# Altium schematic sheet digital_host_for_ADS1216_MAX337_to_Hall_1.SchDoc
size 420 x 297 mm; Address1: Address1; Address2: Address2; Address3: Address3; Address4: Address4; SheetNumber: 1; Scale: 1:1; Разраб.: Иванов; Обозначение документа: АБВГ.123456.001 Э3; Пров.: Петров; Утв.: Сидоров; Наименование организации: ОАО "Концерн "МПО-Гидроприбор"; Перв. применение: АБВГ.123456.000; Наименование изделия 1: Плата; Наименование изделия 2: Схема электрическая; Наименование изделия 3: принципиальная; Нач. отд.: Нач. отд.; Фамилия нач. отд.: Сидоров
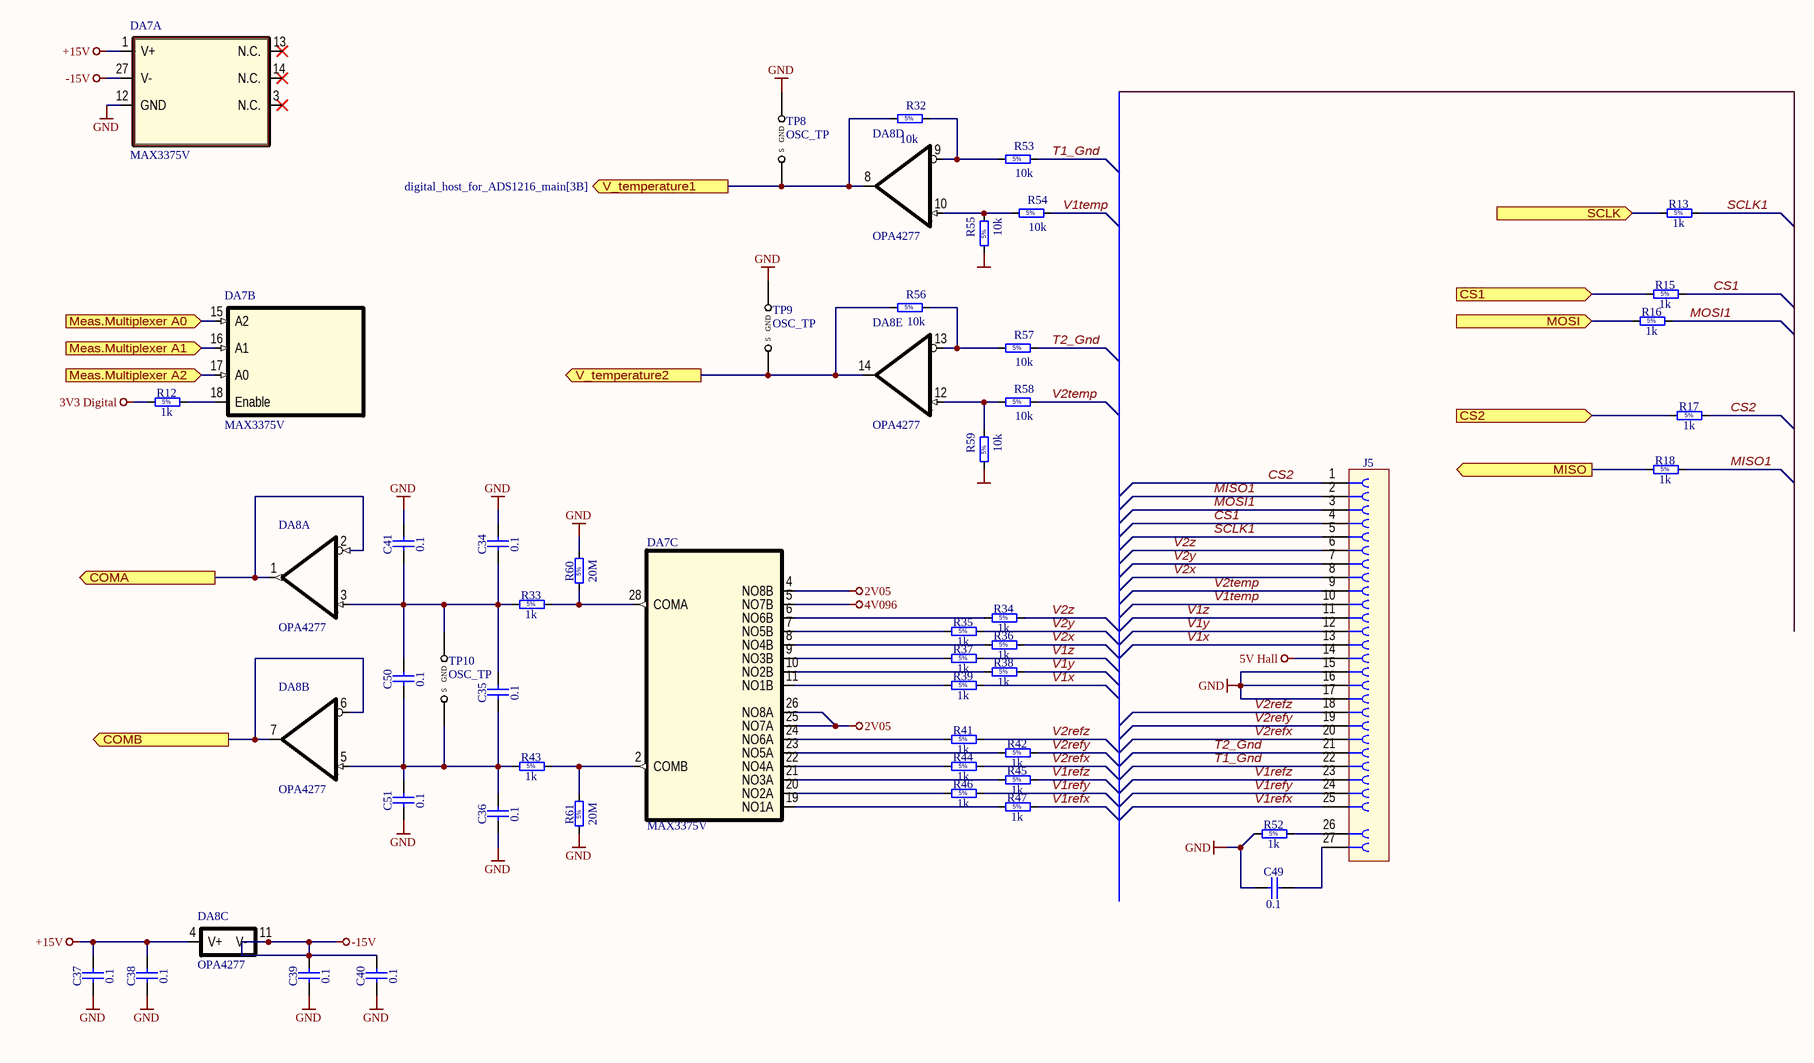
[diagram p0: digital_host_for_ADS1216_MAX337_to_Hall_1.SchDoc]

## Parts
C34  0.1  [CAPC2012X90N]
C35  0.1  [CAPC2012X90N]
C36  0.1  [CAPC2012X90N]
C37  0.1  [CAPC2012X90N]
C38  0.1  [CAPC2012X90N]
C39  0.1  [CAPC2012X90N]
C40  0.1  [CAPC2012X90N]
C41  0.1  [CAPC2012X90N]
C49  0.1  [CAPC2012X90N]
C50  0.1  [CAPC2012X90N]
C51  0.1  [CAPC2012X90N]
DA7  MAX3375V  [SOIC127P1030X265-28N]  (parts A,B,C of 3)
DA8  OPA4277  [SOIC14]  (parts A,B,C,D,E of 5)
J5  (no value)  [TYCO_3-1634582-2]
R12  1k  [RESC2012X70N]
R13  1k  [RESC2012X70N]
R15  1k  [RESC2012X70N]
R16  1k  [RESC2012X70N]
R17  1k  [RESC2012X70N]
R18  1k  [RESC2012X70N]
R32  10k  [RESC2012X70N]
R33  1k  [RESC2012X70N]
R34  1k  [RESC2012X70N]
R35  1k  [RESC2012X70N]
R36  1k  [RESC2012X70N]
R37  1k  [RESC2012X70N]
R38  1k  [RESC2012X70N]
R39  1k  [RESC2012X70N]
R41  1k  [RESC2012X70N]
R42  1k  [RESC2012X70N]
R43  1k  [RESC2012X70N]
R44  1k  [RESC2012X70N]
R45  1k  [RESC2012X70N]
R46  1k  [RESC2012X70N]
R47  1k  [RESC2012X70N]
R52  1k  [RESC2012X70N]
R53  10k  [RESC2012X70N]
R54  10k  [RESC2012X70N]
R55  10k  [RESC2012X70N]
R56  10k  [RESC2012X70N]
R57  10k  [RESC2012X70N]
R58  10k  [RESC2012X70N]
R59  10k  [RESC2012X70N]
R60  20M  [RESC2012X70N]
R61  20M  [RESC2012X70N]
TP8  OSC_TP  [TP2]
TP9  OSC_TP  [TP2]
TP10  OSC_TP  [TP2]

## Ports
COMA (out, see digital_host_for_ADS1216_main[3C]), COMB (out, see digital_host_for_ADS1216_main[3C]), CS1 (in, see digital_host_for_ADS1216_main[3C]), CS2 (in, see digital_host_for_ADS1216_main[3C]), Meas.Multiplexer A0 (in, see digital_host_for_ADS1216_main[3B]), Meas.Multiplexer A1 (in, see digital_host_for_ADS1216_main[3B]), Meas.Multiplexer A2 (in, see digital_host_for_ADS1216_main[3B]), MISO (out, see digital_host_for_ADS1216_main[3C]), MOSI (in, see digital_host_for_ADS1216_main[3C]), SCLK (in, see digital_host_for_ADS1216_main[3B]), V_temperature1 (out, see digital_host_for_ADS1216_main[3B]), V_temperature2 (out, see digital_host_for_ADS1216_main[3B])

## Nets
2V05: DA7.4(NO8B) DA7.25(NO7A) DA7.26(NO8A)
3V3 Digital: R12.1
4V096: DA7.5(NO7B)
5V Hall: J5.14
+15V: C37.2 C38.2 DA7.1(V+) DA8.4(V+)
-15V: C39.2 C40.2 DA7.27(V-) DA8.11(V-)
GND: C34.2 C36.1 C37.1 C38.1 C39.1 C40.1 C41.2 C49.1 C51.1 DA7.12(GND) J5.15 J5.16 J5.17 R52.1 R55.1 R59.1 R60.2 R61.1 TP8.2(GND) TP9.2(GND)
COMA: DA8.1(OUT) DA8.2(-) ; port COMA
COMB: DA8.6(-) DA8.7(OUT) ; port COMB
CS1: R15.1 ; port CS1
CS1: J5.4 R15.2  [a separate net that carries the same name]
CS2: R17.1 ; port CS2
CS2: J5.1 R17.2  [a separate net that carries the same name]
Meas.Multiplexer A0: DA7.15(A2) ; port Meas.Multiplexer A0
Meas.Multiplexer A1: DA7.16(A1) ; port Meas.Multiplexer A1
Meas.Multiplexer A2: DA7.17(A0) ; port Meas.Multiplexer A2
MISO: R18.1 ; port MISO
MISO1: J5.2 R18.2
MOSI: R16.1 ; port MOSI
MOSI1: J5.3 R16.2
SCLK: R13.1 ; port SCLK
SCLK1: J5.5 R13.2
T1_Gnd: J5.22 R53.2
T2_Gnd: J5.21 R57.2
V1refx: J5.25 R47.2
V1refy: J5.24 R46.2
V1refz: J5.23 R45.2
V1temp: J5.10 R54.2
V1x: J5.13 R39.2
V1y: J5.12 R38.2
V1z: J5.11 R37.2
V2refx: J5.20 R44.2
V2refy: J5.19 R42.2
V2refz: J5.18 R41.2
V2temp: J5.9 R58.2
V2x: J5.8 R36.2
V2y: J5.7 R35.2
V2z: J5.6 R34.2
V_temperature1: DA8.8(OUT) R32.1 TP8.1(S) ; port V_temperature1
V_temperature2: DA8.14(OUT) R56.1 TP9.1(S) ; port V_temperature2
NetC34_1: C34.1 C35.2 C41.1 C50.2 DA8.3(+) R33.1 TP10.2(GND)
NetC35_1: C35.1 C36.2 C50.1 C51.2 DA8.5(+) R43.1 TP10.1(S)
NetC49_2: C49.2 J5.27
NetDA7_2: DA7.2(COMB) R43.2 R61.2
NetDA7_6: DA7.6(NO6B) R34.1
NetDA7_7: DA7.7(NO5B) R35.1
NetDA7_8: DA7.8(NO4B) R36.1
NetDA7_9: DA7.9(NO3B) R37.1
NetDA7_10: DA7.10(NO2B) R38.1
NetDA7_11: DA7.11(NO1B) R39.1
NetDA7_18: DA7.18(Enable) R12.2
NetDA7_19: DA7.19(NO1A) R47.1
NetDA7_20: DA7.20(NO2A) R46.1
NetDA7_21: DA7.21(NO3A) R45.1
NetDA7_22: DA7.22(NO4A) R44.1
NetDA7_23: DA7.23(NO5A) R42.1
NetDA7_24: DA7.24(NO6A) R41.1
NetDA7_28: DA7.28(COMA) R33.2 R60.1
NetDA8_9: DA8.9(-) R32.2 R53.1
NetDA8_10: DA8.10(+) R54.1 R55.2
NetDA8_12: DA8.12(+) R58.1 R59.2
NetDA8_13: DA8.13(-) R56.2 R57.1
NetJ5_26: J5.26 R52.2

Not connected (* = marked no-connect by the designer): DA7 3(N.C.)* 13(N.C.)* 14(N.C.)*

## Notes on the sheet
- Перв. примен.
- Справ. №
- Подп. и дата
- Инв. № дубл.
- Взам. инв. №
- Разраб.
- Изм.
- Лист
- № докум.
- Подп.
- Дата
- Лит.
- Масса
- Масштаб
- Пров.
- Т.контр.
- Листов
- Инв. № подл.
- Утв.
- Н.контр.
- Копировал
- Формат А3

## Library data of the parts
C34-C41 C49-C51 = Capacitor - non polarized: Non-polarised capacitor2012; SolderOption: 0; SMD Solders: 2; Dielectric type: X5R; Vendor: any; Value: 0.1; THD Solders: 0
DA7 = MAX337: Positive LDO Linear stabilizer; Vendor: Texas Instruments; Value: 5V; SMD Solder: 6; THD Solder: 0; Device: MAX337; Unit Price: 6; Package: SOT223-6; SolderOption: 0
DA8 = OPA4277: счетверённый ОУ; Vendor: Texas Instruments; Voltage: 3..30V/+-1.5..+-15V; Bandwidth: 1.3MHz; SolderOption: Norm; Value: OPA4277
J5 = Connector 25 Male: Solder Option: 0; THD Solders: 27; SMD Solders: 0; Vendor: *; Value: *
R12 R13 R15-R18 R32-R39 R41-R47 R52-R61 = Resistor - 5%: Vendor: any; SMD Solders: 2; THD Solders: 0; TK: 1000ppmC^(-1); SolderOption: 0; Tolerance: 5%
  R12 R13 R15-R18 R33-R39 R41-R47 R52: Value: 1k
  R32 R53-R59: Value: 10k
  R60 R61: Value: 20M
TP8-TP10 = OscTP: Контрольная точка для подключения осциллографа короткой землёй; Vendor: PCB; Price: 0; Value: OSC_TP; SolderOption: PCB